# EAGLE design UnoMuxShieldV1.0 (EAGLE 7.7.0)
DESIGN_BY_TAIGA: Dr. Taiga (VAW); DESIGN_BY_VAW: Vincent A. Webb
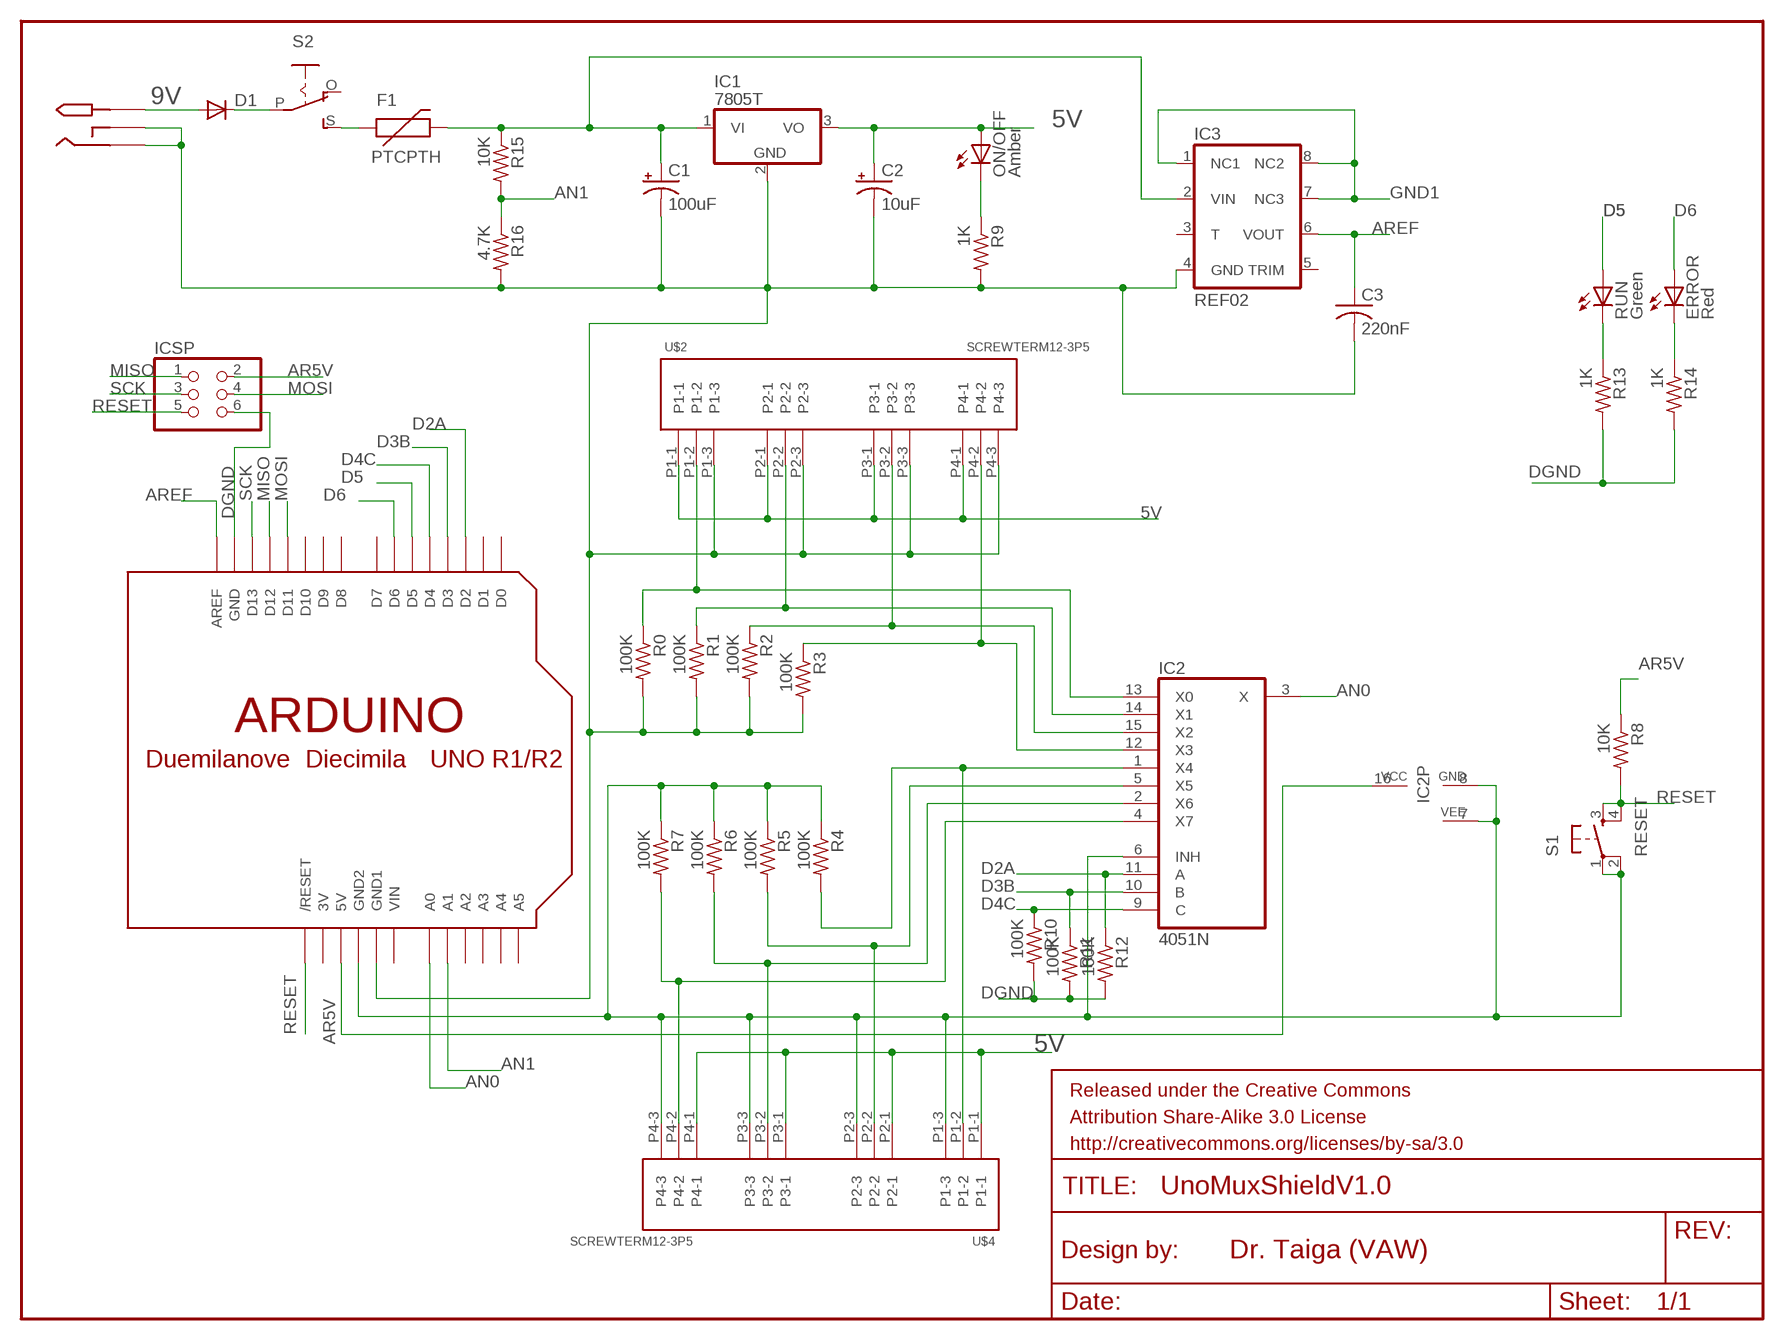
[diagram p0: schematic, sheet 1]

## Parts
C1  100uF  CPOL-USE2,5-6E  [E2,5-6E]
C2  10uF  CPOL-USE1.8-4  [E1,8-4]
C3  220nF  C-US050-024X044  [C050-024X044]
D1  DIODEPTH  [DIODE-1N4001]
ERROR  Red  LED3MM  [LED3MM]
F1  PTCPTH  [PTC]
IC1  7805T  [TO220H]
IC2  4051N  [DIL16]
IC3  REF02  [DIL08]
ICSP  PINHD-2X3  [2X03]
ON/OFF  Amber  LED3MM  [LED3MM]
R0  100K  R-US_0207/10  [0207/10]
R1  100K  R-US_0207/10  [0207/10]
R2  100K  R-US_0207/10  [0207/10]
R3  100K  R-US_0207/10  [0207/10]
R4  100K  R-US_0207/10  [0207/10]
R5  100K  R-US_0207/10  [0207/10]
R6  100K  R-US_0207/10  [0207/10]
R7  100K  R-US_0207/10  [0207/10]
R8  10K  R-US_0207/10  [0207/10]
R9  1K  R-US_0207/10  [0207/10]
R10  100K  R-US_0207/10  [0207/10]
R11  100K  R-US_0207/10  [0207/10]
R12  100K  R-US_0207/10  [0207/10]
R13  1K  R-US_0207/10  [0207/10]
R14  1K  R-US_0207/10  [0207/10]
R15  10K  R-US_0207/10  [0207/10]
R16  4.7K  R-US_0207/10  [0207/10]
RUN  Green  LED3MM  [LED3MM]
S1  RESET  TAC_SWITCHPTH  [TACTILE-PTH]
S2  EG1218S  [EG1218]
U$1  ARDUINO-NOHOLE  [ARDUINO-NOHOLE]
U$2  SCREWTERM12-3P5  [SCREWTERM3P5]
U$4  SCREWTERM12-3P5  [SCREWTERM3P5]
U$5  PJ-102-A  [PJ-102-A]

## Nets
5V: C2.+ IC1.3(VO) ON/OFF.A U$2.P1-1 U$2.P2-1 U$2.P3-1 U$2.P4-1 U$4.P1-1 U$4.P2-1 U$4.P3-1 U$4.P4-1
9V: D1.A U$5.P$1_TIP(TIP)
AN0: IC2.3(X) U$1.A0
AN1: R15.2 R16.1 U$1.A1
AR5V: IC2.16(VCC) ICSP.2 R8.1 U$1.5V
AREF: C3.1 IC3.6(VOUT) U$1.AREF
D2A: IC2.11(A) R12.1 U$1.D2
D3B: IC2.10(B) R11.1 U$1.D3
D4C: IC2.9(C) R10.1 U$1.D4
D5: RUN.A U$1.D5
D6: ERROR.A U$1.D6
DGND: ICSP.6 R10.2 R11.2 R12.2 R13.2 R14.2 U$1.GND
GND1: IC3.1(NC1) IC3.7(NC3) IC3.8(NC2)
MISO: ICSP.1 U$1.D12
MOSI: ICSP.4 U$1.D11
N$1: IC2.13(X0) R0.1 U$2.P1-2
N$2: D1.C S2.P
N$3: F1.P$1 S2.S
N$4: C1.- C2.- C3.2 IC1.2(GND) IC3.4(GND) R0.2 R1.2 R2.2 R3.2 R9.2 R16.2 U$1.GND1 U$2.P1-3 U$2.P2-3 U$2.P3-3 U$2.P4-3 U$5.P$2_SLEEVE(SLEEVE) U$5.P$3_SHUNT(SHUNT)
N$5: IC2.12(X3) R3.1 U$2.P4-2
N$6: ON/OFF.K(C) R9.1
N$7: IC2.6(INH) IC2.7(VEE) IC2.8(GND) R4.1 R5.1 R6.1 R7.1 S1.1 S1.2 U$1.GND2 U$4.P1-3 U$4.P2-3 U$4.P3-3 U$4.P4-3
N$8: IC2.1(X4) R4.2 U$4.P1-2
N$9: IC2.5(X5) R5.2 U$4.P2-2
N$10: IC2.2(X6) R6.2 U$4.P3-2
N$11: IC2.4(X7) R7.2 U$4.P4-2
N$12: IC2.15(X2) R2.1 U$2.P3-2
N$13: R13.1 RUN.K(C)
N$14: ERROR.K(C) R14.1
N$15: C1.+ F1.P$2 IC1.1(VI) IC3.2(VIN) R15.1
N$16: IC2.14(X1) R1.1 U$2.P2-2
RESET: ICSP.5 R8.2 S1.3 S1.4 U$1.RESET(/RESET)
SCK: ICSP.3 U$1.D13
Unconnected: IC3.3(T) S2.O U$1.A2 U$1.A3 U$1.A4 U$1.A5 U$1.D0 U$1.D1 U$1.D7 U$1.D8 U$1.D9 U$1.D10

## Notes on the sheet
- /Users/vaw/Desktop/Taiga1.bmp

## Power pins joined to a net without a drawn wire
3V: U$1.3V
TRIM: IC3.5(TRIM)
VIN: U$1.VIN

## Library data of the parts
C1 C2 = adafruit:CPOL-US: POLARIZED CAPACITOR, American symbol
C3 = rcl:C-US: CAPACITOR, American symbol
D1 = SparkFun-DiscreteSemi:DIODE: Diode These are standard reverse protection diodes and small signal diodes. SMA package can handle up to about 1A. SOD-323 can handle about 200mA. What the SOD-323 package when ordering, there are some mfgs out there that are 5-pin packages.
ERROR ON/OFF RUN = adafruit:LED: LED OSRAM: - CHIPLED LG R971, LG N971, LY N971, LG Q971, LY Q971, LO R971, LY R971 LH N974, LH R974 LS Q976, LO Q976, LY Q976 LO Q996 - Hyper CHIPLED LW Q18S LB Q993, LB Q99A, LB R99A - SideLED LS A670, LO A670, LY A670, LG A670, LP A670 LB A673, LV A673, LT A673, LW A673 LH A674 LY A675 LS A676, LA A676, LO A676, LY A676, LW A676 LS A679, LY A679, LG A679 - Hyper Micro SIDELED® LS Y876, LA Y876, LO Y876, LY Y876 LT Y87S - SmartLED LW L88C, LW L88S LB L89C, LB L89S, LG L890 LS L89K, LO L89K, LY L89K LS L896, LA L896, LO L896, LY L896 - TOPLED LS T670, LO T670, LY T670, LG T670, LP T670 LSG T670, LSP T670, LSY T670, LOP T670, LYG T670 LG T671, LOG T671, LSG T671 LB T673, LV T673, LT T673, LW T673 LH T674 LS T676, LA T676, LO T676, LY T676, LB T676, LH T676, LSB T676, LW T676 LB T67C, LV T67C, LT T67C, LS T67K, LO T67K, LY T67K, LW E67C LS E67B, LA E67B, LO E67B, LY E67B, LB E67C, LV E67C, LT E67C LW T67C LS T679, LY T679, LG T679 LS T770, LO T770, LY T770, LG T770, LP T770 LB T773, LV T773, LT T773, LW T773 LH T774 LS E675, LA E675, LY E675, LS T675 LS T776, LA T776, LO T776, LY T776, LB T776 LHGB T686 LT T68C, LB T68C - Hyper Mini TOPLED® LB M676 - Mini TOPLED Santana® LG M470 LS M47K, LO M47K, LY M47K Source: http://www.osram.convergy.de/
F1 = SparkFun-PowerIC:PTC: Resettable Fuse PTC Resettable Fuse. Spark Fun Electronics SKU : COM-08357
IC1 = adafruit:78*: Positive VOLTAGE REGULATOR Added bigger pads to the TO-92 package
IC2 = 40xx:4051: 8-channel ANALOG MULTIPLEXER
IC3 = VAW:REF02
ICSP = SparkFun-Connectors:PINHD-2X3: PIN HEADER
R0 R1-R16 = rcl:R-US_: RESISTOR, American symbol
S1 = SparkFun-Electromechanical:TAC_SWITCH: Momentary Switch Button commonly used for reset or general input. Spark Fun Electronics SKU : COM-00097
S2 = adafruit:EG1218: SLIDING SWITCH 0.1" spacing through hole, vertical SPDT slide switch http://www.ladyada.net/library/pcb/eaglelibrary.html
U$1 = adafruit:ARDUINO: Arduino Diecimila/Duemilanove Make a shield with ease, this package has all the named pins as well as the two mounting drill holes and an outline of the USB and DC power connector. The outline is on the DIMENSION layer, so if your board house uses it they will cut the outline to match. http://www.ladyada.net/library/pcb/eaglelibrary.html
U$2 U$4 = VAW:SCREWTERM12-3P5
U$5 = VAW:PJ-102-A

## Board
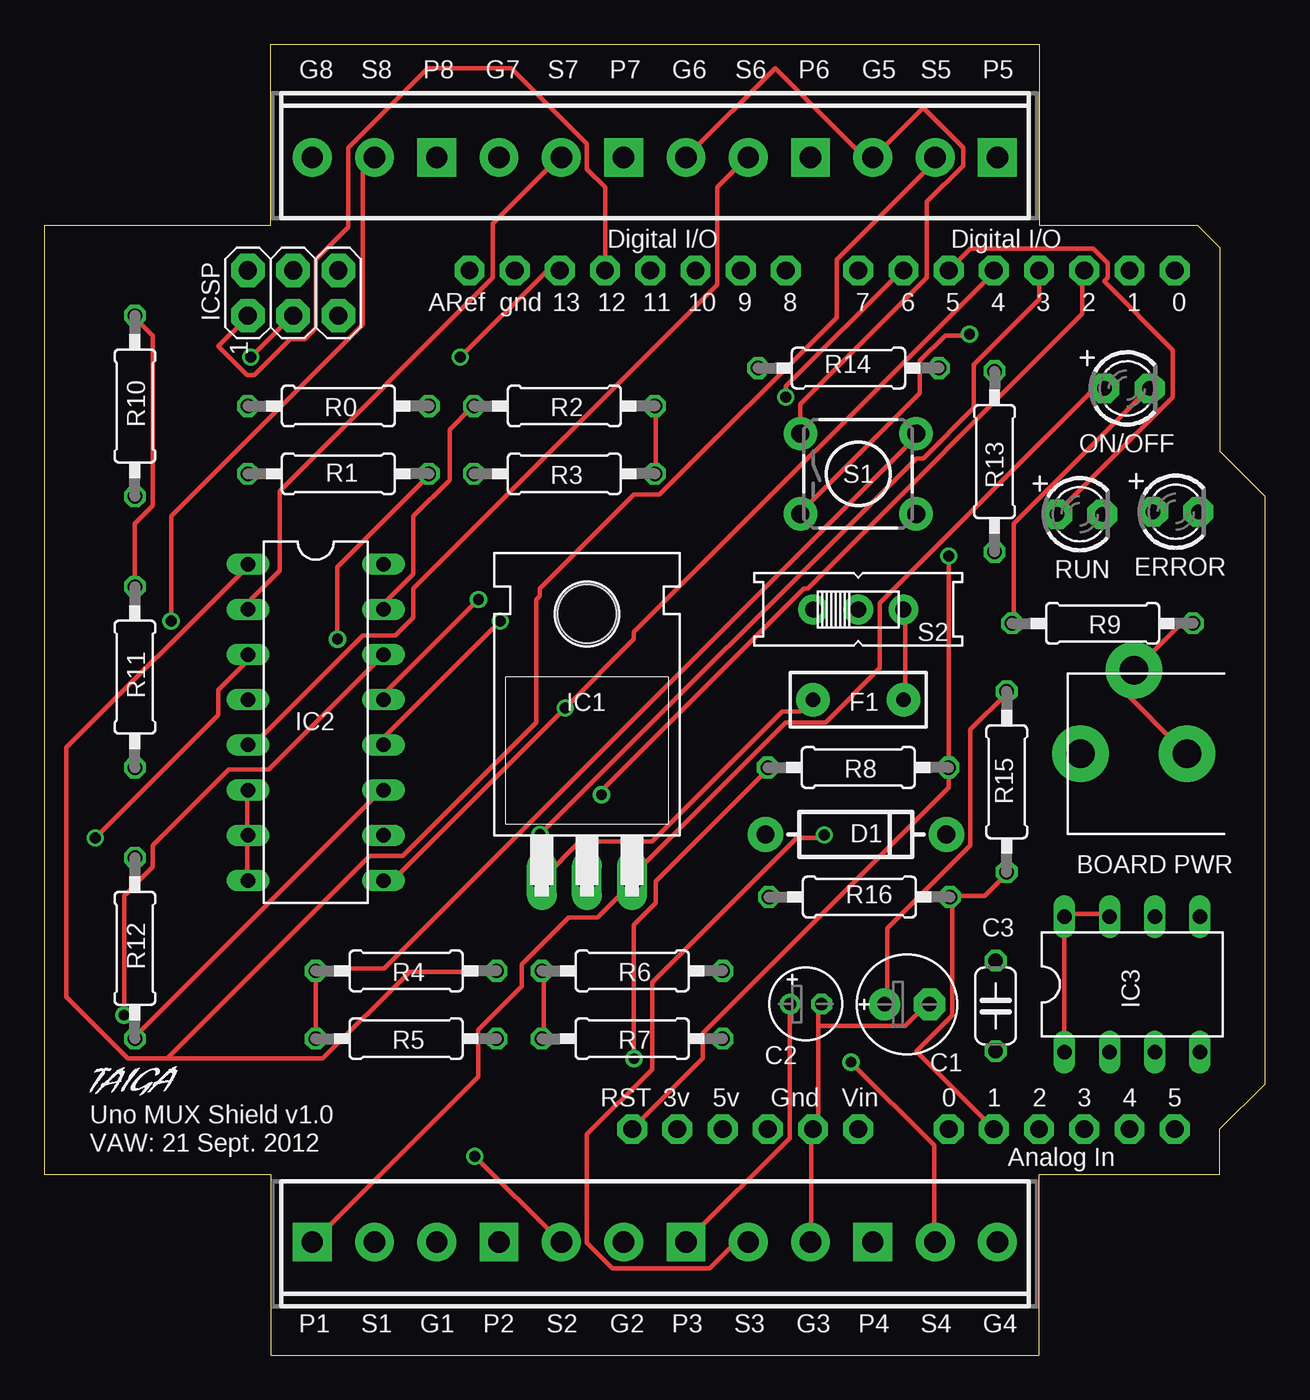
[diagram p1: board, top side]
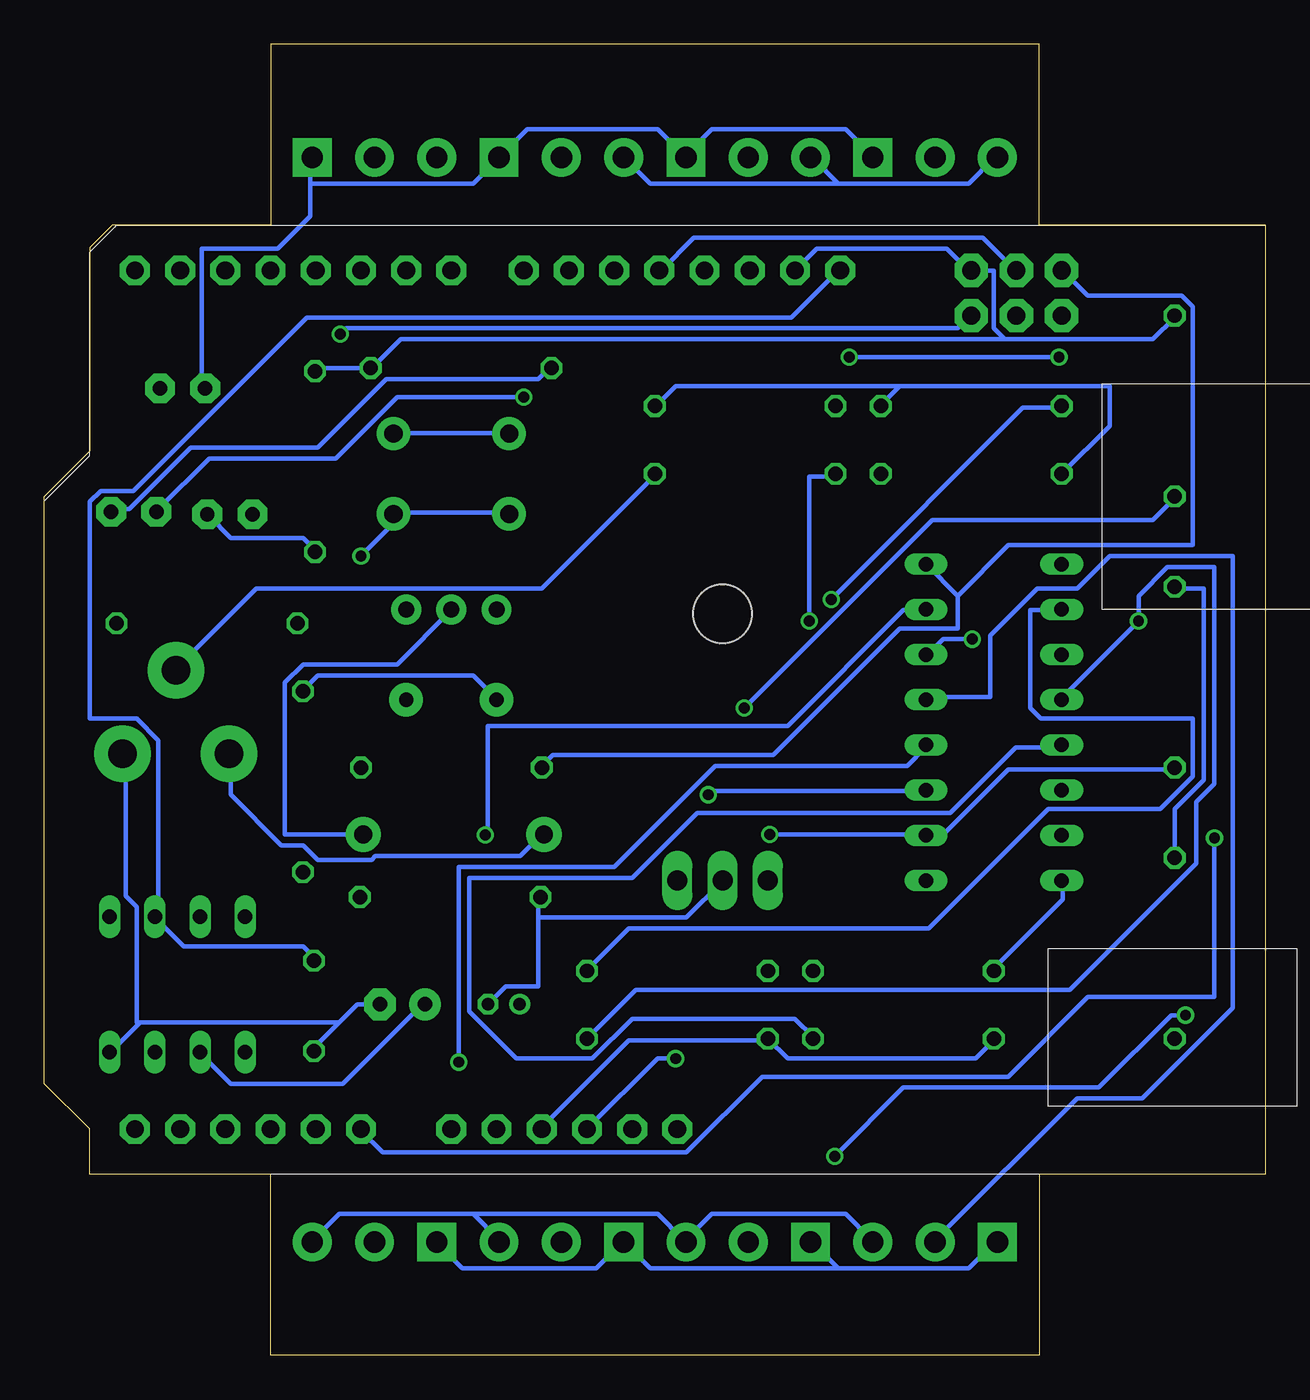
[diagram p2: board, bottom side, seen from below]

Size 68.58 x 73.66 mm. Coordinates in mm from the lower left corner, seen from the top.
Outline: 12.7,0 55.88,0 55.88,10.16 66.04,10.16 66.04,12.7 68.58,15.24 68.58,48.26 66.04,50.8 66.04,62.23 64.77,63.5 55.88,63.5 55.88,73.66 12.7,73.66 12.7,63.5 0,63.5 0,10.16 12.7,10.16 12.7,0
Copper layers (1*16): Top 0.0356mm / dielectric 1.5011mm / Bottom 0.0356mm
Design rules: minimum track width 6mil, minimum drill 13mil, track to track 6mil, track to pad 6mil, pad to pad 6mil, via to via 6mil, smd to smd 6mil, copper to edge 15mil, drill to drill 6mil, minimum pad ring 7mil, minimum via ring 7mil, stop-mask expansion 4mil, vias tented up to drill 0mil, thermal gap 10mil

### Footprints (pad centres in the part's own frame; a part is rotated, then mirrored left to right if it is on the bottom)
E2,5-6E = drill 0.813 pad 1.778: + -1.27,0 | drill 0.813 pad 1.778 octagon: - 1.27,0
E1,8-4 = drill 0.711 pad 1.168: + -0.889,0 | drill 0.711 pad 1.168 octagon: - 0.889,0
C050-024X044 = drill 0.813 octagon: 1 -2.54,0; 2 2.54,0
DIODE-1N4001 = drill 1 pad 1.981: A -5.08,0; C 5.08,0
LED3MM = drill 0.813 pad 1.676 octagon: A -1.27,0; K 1.27,0
PTC = drill 0.8 pad 1.88: P$1 -2.54,0; P$2 2.54,0
TO220H = drill 1.118 long: 1 -2.54,-10.16; 2 0,-10.16; 3 2.54,-10.16 | hole 3.302: 0,4.826
DIL16 = drill 0.813 long: 1 -8.89,-3.81; 2 -6.35,-3.81; 3 -3.81,-3.81; 4 -1.27,-3.81; 5 1.27,-3.81; 6 3.81,-3.81; 7 6.35,-3.81; 8 8.89,-3.81; 9 8.89,3.81; 10 6.35,3.81; 11 3.81,3.81; 12 1.27,3.81; 13 -1.27,3.81; 14 -3.81,3.81; 15 -6.35,3.81; 16 -8.89,3.81
DIL08 = drill 0.813 long: 1 -3.81,-3.81; 2 -1.27,-3.81; 3 1.27,-3.81; 4 3.81,-3.81; 5 3.81,3.81; 6 1.27,3.81; 7 -1.27,3.81; 8 -3.81,3.81
2X03 = drill 1.016 pad 1.88 octagon: 1 -2.54,-1.27; 2 -2.54,1.27; 3 0,-1.27; 4 0,1.27; 5 2.54,-1.27; 6 2.54,1.27
0207/10 = drill 0.813 octagon: 1 -5.08,0; 2 5.08,0
TACTILE-PTH = drill 1.016 pad 1.88: 1 -3.251,2.261; 2 3.251,2.261; 3 -3.251,-2.261; 4 3.251,-2.261
EG1218 = drill 0.9 pad 1.676: O -2.54,0; P 0,0; S 2.54,0
ARDUINO-NOHOLE = drill 1 pad 1.676 octagon: 3V 35.56,2.54; 5V 38.1,2.54; A0 50.8,2.54; A1 53.34,2.54; A2 55.88,2.54; A3 58.42,2.54; A4 60.96,2.54; A5 63.5,2.54; AREF 23.876,50.8; D0 63.5,50.8; D1 60.96,50.8; D2 58.42,50.8; D3 55.88,50.8; D4 53.34,50.8; D5 50.8,50.8; D6 48.26,50.8; D7 45.72,50.8; D8 41.656,50.8; D9 39.116,50.8; D10 36.576,50.8; D11 34.036,50.8; D12 31.496,50.8; D13 28.956,50.8; GND 26.416,50.8; GND1 43.18,2.54; GND2 40.64,2.54; RESET 33.02,2.54; VIN 45.72,2.54
SCREWTERM3P5 = drill 1.2 pad 2.184 square: P1-1 -19.25,0; P2-1 -8.75,0; P3-1 1.75,0; P4-1 12.25,0 | drill 1.2 pad 2.184: P1-2 -15.75,0; P1-3 -12.25,0; P2-2 -5.25,0; P2-3 -1.75,0; P3-2 5.25,0; P3-3 8.75,0; P4-2 15.75,0; P4-3 19.25,0
PJ-102-A = drill 1.6 pad 3.175: P$1_TIP 0,-3; P$2_SLEEVE 0,3; P$3_SHUNT -4.7,0

### Placement (x,y rotation side)
C1  48.46,19.71 0 top
C2  42.77,19.72 0 top
C3  53.44,19.62 270 top
D1  45.59,29.26 0 top
ERROR  63.56,47.4 0 top
F1  45.72,36.83 180 top
IC1  30.48,36.83 0 top
IC2  15.24,35.56 270 top
IC3  61.11,20.83 0 top
ICSP  13.97,59.69 0 top
ON/OFF  60.82,54.33 0 top
R0  16.51,53.34 0 top
R1  16.51,49.53 180 top
R2  29.21,53.34 0 top
R3  29.21,49.53 0 top
R4  20.32,21.59 0 top
R5  20.32,17.78 0 top
R6  33.02,21.59 0 top
R7  33.02,17.78 0 top
R8  45.72,33.02 0 top
R9  59.45,41.12 0 top
R10  5.08,53.34 90 top
R11  5.08,38.1 90 top
R12  5.08,22.86 90 top
R13  53.38,50.22 90 top
R14  45.17,55.47 0 top
R15  54.06,32.22 270 top
R16  45.78,25.74 180 top
RUN  58.17,47.26 0 top
S1  45.72,49.53 0 top
S2  45.72,41.91 0 top
U$1  0,10.16 0 top
U$2  34.29,6.35 0 top
U$4  34.29,67.31 180 top
U$5  61.2,33.79 270 top

### Tracks (layer width: path | path; a pad name or v marks a point on that pad's centre or on a via)
5V
  Top 0.254: C2.+ 41.86,19.71 41.86,12.19 36.17,6.5 U$2.P3-1 | U$2.P1-1 15.24,6.5 24.38,15.65 24.38,18.29 26.82,20.73 26.82,21.95 29.46,24.59 31.09,24.59 32.92,26.42 32.92,26.62 IC1.3 32.92,26.82 41.66,35.56 43.89,35.56 46.94,38.61 46.94,42.27 58.93,54.25 59.54,54.25 ON/OFF.A
  Bottom 0.254: U$4.P4-1 22.15,67.46 23.57,68.89 31.09,68.89 32.51,67.46 U$4.P3-1 32.72,67.46 34.14,68.89 41.45,68.89 42.88,67.46 U$4.P2-1 43.08,67.26 44.5,65.84 53.65,65.84 | 53.65,65.84 53.65,67.26 U$4.P1-1 | 53.65,65.84 53.65,64.01 55.47,62.18 59.74,62.18 59.74,54.46 ON/OFF.A | U$2.P4-1 46.53,6.3 45.11,4.88 37.59,4.88 36.17,6.3 U$2.P3-1 35.97,6.3 34.54,4.88 23.98,4.88 | 23.98,4.88 25.4,6.3 U$2.P2-1 | 23.98,4.88 16.66,4.88 15.24,6.3 U$2.P1-1
9V
  Bottom 0.254: D1.A 40.64,29.26 41.86,28.04 49.99,28.04 50.19,27.84 53.24,27.84 54.05,28.65 55.27,28.65 58.12,31.5 58.12,33.73 U$5.P$1_TIP
AN0  (via drill 0.61)
  Top 0.254: v2.85,29.06 9.75,35.97 9.75,37.39 11.38,39.01 11.38,39.22 IC2.3
  Bottom 0.254: v2.85,29.06 2.85,20.12 9.96,20.12 14.43,15.65 28.25,15.65 32.51,11.38 49.58,11.38 50.8,12.6 U$1.A0
AN1
  Top 0.254: R15.2 54.05,27.03 52.83,25.81 51,25.81 R16.1 51,25.6 51,19.1 48.97,17.07 U$1.A1
AR5V  (via drill 0.61)
  Top 0.254: v33.12,16.66 33.12,24.18 34.34,25.4 34.34,26.62 40.64,32.92 R8.1
  Bottom 0.254: 17.27,42.67 IC2.16 | 17.27,42.67 17.27,40.84 20.52,40.84 27.64,33.73 40.03,33.73 40.64,33.12 R8.1 | U$1.5V 34.14,16.66 v33.12,16.66 | 17.27,42.67 14.43,45.52 4.06,45.52 4.06,58.93 4.67,59.54 9.96,59.54 11.38,60.96 ICSP.2
AREF
  Bottom 0.254: C3.1 53.44,22.35 54.05,22.96 60.76,22.96 62.38,24.59 IC3.6 62.38,24.79 62.18,24.79 62.18,34.54 63.4,35.76 66.04,35.76 66.04,47.95 65.43,48.56 63.6,48.56 53.85,58.32 26.62,58.32 23.98,60.96 U$1.AREF
D2A  (via drill 0.61)
  Top 0.254: R12.1 5.08,17.88 18.9,31.7 IC2.11 | v31.29,31.5 31.29,31.7 42.67,43.08 42.88,43.08 58.32,58.52 58.32,60.96 U$1.D2
  Bottom 0.254: v31.29,31.5 31.09,31.7 19.1,31.7 IC2.11
D3B  (via drill 0.61)
  Top 0.254: U$1.D3 55.88,59.33 52.22,55.68 52.22,53.24 49.38,50.39 48.97,50.39 v27.84,29.26
  Bottom 0.254: R11.1 5.08,32.92 14.43,32.92 18.09,29.26 18.9,29.26 IC2.10 19.1,29.26 v27.84,29.26
D4C  (via drill 0.61)
  Top 0.254: IC2.9 19.1,26.82 19.71,26.82 v29.26,36.37 33.12,40.23 33.12,40.64 53.44,60.96 U$1.D4
  Bottom 0.254: v29.26,36.37 18.69,46.94 6.3,46.94 5.08,48.16 R10.1
D5
  Top 0.254: U$1.D5 52.02,62.18 58.93,62.18 59.74,61.37 59.74,60.55 59.54,60.35 63.4,56.49 63.4,53.85 56.9,47.35 RUN.A
D6  (via drill 0.61)
  Top 0.254: v41.66,53.85 41.66,54.46 48.16,60.96 U$1.D6
  Bottom 0.254: v41.66,53.85 48.77,53.85 52.22,50.39 59.33,50.39 62.18,47.55 ERROR.A
DGND
  Top 0.254: R11.2 5.08,46.74 6.1,47.75 6.1,57.3 5.08,58.32 R10.2
  Bottom 0.254: R12.2 5.08,30.68 3.45,32.31 3.45,43.08 5.08,43.08 R11.2 | R13.2 53.24,55.47 R14.2 50.19,55.47 48.56,57.1 14.63,57.1 | 14.63,57.1 6.3,57.1 5.08,58.32 R10.2 | 14.63,57.1 15.24,57.71 15.24,60.96 ICSP.6 16.66,60.96 17.88,62.18 25.2,62.18 U$1.GND
GND1
  Top 0.254: IC3.1 IC3.8 57.3,24.79 59.74,24.79 IC3.7
MISO
  Top 0.254: U$1.D12 31.5,65.63 30.48,66.65 30.48,68.07 26.21,72.34 21.54,72.34 17.07,67.87 17.07,63.4 15.24,61.57 15.24,57.71 14.63,57.1 13.82,57.1 11.79,55.07 11.38,55.07 9.75,56.69 11.38,58.32 ICSP.1
MOSI
  Bottom 0.254: U$1.D11 33.93,60.96 32.11,62.79 15.85,62.79 14.02,60.96 ICSP.4
N$1  (via drill 0.61)
  Top 0.254: v24.38,42.47 19.1,37.19 19.1,36.98 IC2.13
  Bottom 0.254: v24.38,42.47 13.61,53.24 11.58,53.24 R0.1 | U$2.P1-2 18.49,6.5 10.57,14.43 6.91,14.43 1.83,19.51 1.83,44.91 8.74,44.91 10.57,43.08 12.8,43.08 15.44,40.44 15.44,36.98 18.9,36.98 IC2.13
N$2
  Bottom 0.254: D1.C 55.07,29.26 55.07,37.8 54.05,38.81 48.77,38.81 45.72,41.86 S2.P
N$3
  Top 0.254: S2.S 48.36,41.86 48.36,36.98 F1.P$1
N$4
  Top 0.254: 43.48,18.49 43.48,13.01 U$1.GND1 43.08,12.6 43.08,6.5 U$2.P3-3 | 43.48,18.49 43.48,19.71 C2.- | R3.2 34.34,49.58 34.34,53.24 R2.2 | R9.2 64.41,41.05 63.8,41.05 61.37,38.61 U$5.P$3_SHUNT 61.16,38.41 60.35,37.59 64.01,33.93 U$5.P$2_SLEEVE | 43.48,18.49 48.36,18.49 49.58,19.71 C1.-
  Bottom 0.254: U$2.P1-3 22.15,6.5 23.57,7.92 31.09,7.92 32.51,6.5 U$2.P2-3 32.72,6.5 34.14,7.92 44.5,7.92 | 40.84,24.59 40.84,20.73 42.67,20.73 43.48,19.91 C2.- | 40.84,24.59 40.84,25.6 R16.2 | 40.84,24.59 32.51,24.59 30.48,26.62 IC1.2 | 44.5,7.92 52.02,7.92 53.44,6.5 U$2.P4-3 | 44.5,7.92 43.08,6.5 U$2.P3-3 | R1.2 8.74,52.22 8.74,54.46 20.52,54.46 | 20.52,54.46 21.54,53.44 R0.2 | 20.52,54.46 33.12,54.46 34.14,53.44 R2.2 | 52.02,18.69 51,19.71 C1.- | 52.02,18.69 53.44,17.27 C3.2 | 63.2,18.69 64.82,17.07 IC3.4 | 52.02,18.69 63.2,18.69 | 63.2,18.69 63.4,18.69 63.4,25.2 64.01,25.81 64.01,33.73 U$5.P$2_SLEEVE | R3.2 34.34,49.38 40.64,43.08 56.69,43.08 61.16,38.61 U$5.P$3_SHUNT
N$5  (via drill 0.61)
  Top 0.254: v25.6,41.25 19.1,34.75 19.1,34.34 IC2.12 | v45.31,16.46 49.99,11.79 49.99,6.5 U$2.P4-2
  Bottom 0.254: v25.6,41.25 25.6,49.38 24.18,49.38 R3.1 | v45.31,16.46 45.31,27.43 36.58,27.43 30.89,33.12 20.12,33.12 19.1,34.14 IC2.12
N$6
  Top 0.254: R9.1 54.46,41.25 54.46,46.74 61.98,54.25 ON/OFF.K
N$7
  Top 0.254: R5.1 R4.1 15.24,21.74 19.1,21.74 48.97,51.61 S1.2 | IC2.8 11.38,26.82 11.38,29.06 IC2.7 11.38,29.26 11.38,31.7 IC2.6 | R7.1 28.04,17.88 28.04,21.54 R6.1 | U$4.P2-3 36.17,67.46 41.05,72.34 45.92,67.46 46.53,67.46 U$4.P1-3 46.74,67.46 49.38,70.1 51.61,67.87 51.61,66.85 49.58,64.82 49.58,60.55 42.47,53.44 S1.1
  Bottom 0.254: R4.1 15.24,21.74 11.38,25.6 11.38,26.62 IC2.8 | U$1.GND2 40.64,12.8 35.76,17.68 28.04,17.68 R7.1 26.82,16.66 16.26,16.66 15.24,17.68 R5.1 | S1.1 42.47,51.82 48.97,51.82 S1.2 | 23.98,65.84 16.66,65.84 15.24,67.26 U$4.P4-3 | 23.98,65.84 25.4,67.26 U$4.P3-3 | 23.98,65.84 34.54,65.84 35.97,67.26 U$4.P2-3
N$8
  Top 0.254: 6.91,16.66 4.67,16.66 1.22,20.12 1.22,34.14 11.38,44.3 IC2.1 | 6.91,16.66 15.65,16.66 20.52,21.54 25.4,21.54 R4.2 | 6.91,16.66 18.29,28.04 20.12,28.04 27.64,35.56 27.64,42.47 27.84,42.67 27.84,43.08 33.12,48.36 34.54,48.36 44.5,58.32 44.5,61.57 49.99,67.06 49.99,67.26 U$4.P1-2
N$9
  Top 0.254: IC2.5 11.58,34.34 11.79,34.34 17.88,40.44 19.71,40.44 20.73,41.45 20.73,43.08 37.8,60.15 37.8,65.63 39.42,67.26 U$4.P2-2
  Bottom 0.254: R5.2 25.4,17.88 26.42,18.9 35.56,18.9 37.8,16.66 42.06,16.66 44.7,19.3 44.7,26.82 35.56,26.82 31.9,30.48 17.68,30.48 14.02,34.14 11.58,34.14 IC2.5
N$10
  Top 0.254: IC2.2 11.58,42.06 11.58,42.47 13.21,44.09 13.21,48.56 25.2,60.55 25.2,63.6 28.85,67.26 U$4.P3-2
  Bottom 0.254: R6.2 38,21.74 35.76,23.98 18.9,23.98 12.19,30.68 5.89,30.68 4.06,32.51 4.06,35.76 12.6,35.76 13.21,36.37 13.21,41.86 11.58,41.86 IC2.2
N$11  (via drill 0.61)
  Top 0.254: v7.11,41.25 7.11,47.14 17.88,57.91 17.88,66.65 18.49,67.26 U$4.P4-2
  Bottom 0.254: IC2.4 11.38,36.98 v7.11,41.25 7.11,42.67 5.49,44.3 2.85,44.3 2.85,32.11 3.86,31.09 3.86,27.64 10.97,20.52 35.36,20.52 R7.2
N$12  (via drill 0.61)
  Top 0.254: IC2.15 19.1,42.06 19.1,42.27 20.73,43.89 20.73,47.14 22.76,49.17 22.76,52.02 23.98,53.24 R2.1 | U$2.P3-2 39.42,6.3 38.81,6.3 37.39,4.88 31.9,4.88 30.48,6.3 30.48,12.39 34.14,16.05 34.14,20.93 42.27,29.06 43.69,29.06 v43.81,29.22
  Bottom 0.254: IC2.15 19.1,41.86 20.32,41.86 26.82,35.36 43.69,35.36 43.69,29.26 v43.81,29.22
N$13
  Bottom 0.254: R13.1 53.44,45.31 54.05,45.92 58.12,45.92 59.33,47.14 RUN.K
N$14
  Bottom 0.254: R14.1 40.23,55.47 40.84,54.86 49.38,54.86 53.24,51 60.35,51 63.8,47.55 64.82,47.55 ERROR.K
N$15
  Top 0.254: IC1.1 28.04,26.82 30.07,28.85 34.14,28.85 41.45,36.17 42.47,36.17 43.08,36.78 F1.P$2 | C1.+ 47.35,19.71 47.35,23.98 52.02,28.65 52.02,35.15 54.05,37.19 R15.1
  Bottom 0.254: IC3.2 59.74,16.87 58.12,15.24 51.82,15.24 47.35,19.71 C1.+ | R15.1 54.05,37.39 53.24,38.2 44.5,38.2 43.28,36.98 F1.P$2
N$16  (via drill 0.61)
  Top 0.254: v16.46,40.23 16.46,44.3 21.54,49.38 R1.1 | v24.18,11.18 28.85,6.5 U$2.P2-2 | v4.47,19.1 4.47,25.81 6.1,27.43 6.1,28.65 10.36,32.92 12.6,32.92 IC2.14
  Bottom 0.254: v16.46,40.23 18.09,40.23 18.9,39.42 IC2.14 | v24.18,11.18 20.32,15.04 9.35,15.04 5.28,19.1 v4.47,19.1
RESET  (via drill 0.61)
  Top 0.254: U$1.RESET 36.98,16.66 36.98,18.09 50.8,31.9 R8.2 v50.8,44.91 | v51.97,57.38 51.82,57.3 50.6,57.3 49.17,55.88 49.17,54.05 42.47,47.35 S1.3
  Bottom 0.254: 48.36,47.35 48.97,47.35 S1.4 48.36,47.35 | 48.36,47.35 42.47,47.35 S1.3 | ICSP.5 16.66,58.32 17.27,57.71 51.61,57.71 51.82,57.51 v51.97,57.38 | 48.36,47.35 v50.8,44.91
SCK  (via drill 0.61)
  Top 0.254: U$1.D13 28.25,60.96 v23.37,56.08 | v11.58,56.08 13.82,58.32 ICSP.3
  Bottom 0.254: v11.58,56.08 v23.37,56.08

### Text on the board
tPlace: G8 | S8 | P8 | G7 | S7 | P7 | G6 | S6 | P6 | G5 | S5 | P5 | 1 | Uno MUX Shield v1.0 | VAW: 21 Sept. 2012 | P1 | S1 | G1 | P2 | S2 | G2 | P3 | S3 | G3 | P4 | S4 | G4 | /Users/vaw/Desktop/Taiga1.bmp
tNames: BOARD PWR